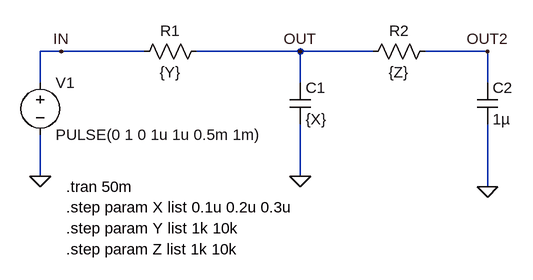
[diagram p0: schematic Cascated_RC_Filter.asc]
Cascated_RC_Filter.asc, the LTspice schematic file:
Version 4
SHEET 1 880 680
WIRE 0 48 -32 48
WIRE 128 48 0 48
WIRE 368 48 208 48
WIRE 480 48 368 48
WIRE 656 48 560 48
WIRE -32 96 -32 48
WIRE 368 96 368 48
WIRE 656 96 656 48
WIRE -32 240 -32 176
WIRE 368 240 368 160
WIRE 656 256 656 160
FLAG -32 240 0
FLAG 368 240 0
FLAG 656 256 0
FLAG 0 48 IN
FLAG 368 48 OUT
FLAG 656 48 OUT2
SYMBOL voltage -32 80 R0
WINDOW 123 0 0 Left 0
WINDOW 39 0 0 Left 0
SYMATTR InstName V1
SYMATTR Value PULSE(0 1 0 1u 1u 0.5m 1m)
SYMBOL res 224 32 R90
WINDOW 0 0 56 VBottom 2
WINDOW 3 32 56 VTop 2
SYMATTR InstName R1
SYMATTR Value {Y}
SYMBOL res 576 32 R90
WINDOW 0 0 56 VBottom 2
WINDOW 3 32 56 VTop 2
SYMATTR InstName R2
SYMATTR Value {Z}
SYMBOL cap 352 96 R0
SYMATTR InstName C1
SYMATTR Value {X}
SYMBOL cap 640 96 R0
SYMATTR InstName C2
SYMATTR Value 1µ
TEXT 8 256 Left 2 !.tran 50m
TEXT 8 288 Left 2 !.step param X list 0.1u 0.2u 0.3u
TEXT 8 320 Left 2 !.step param Y list 1k 10k
TEXT 8 352 Left 2 !.step param Z list 1k 10k

The netlist it stands for:
* Cascated_RC_Filter.asc
V1 IN 0 PULSE(0 1 0 1u 1u 0.5m 1m)
R1 OUT IN {Y}
R2 OUT2 OUT {Z}
C1 OUT 0 {X}
C2 OUT2 0 1µ
.tran 50m
.step param X list 0.1u 0.2u 0.3u
.step param Y list 1k 10k
.step param Z list 1k 10k
.backanno
.end

* Results of the author's LTspice run, read from the files saved beside the schematic
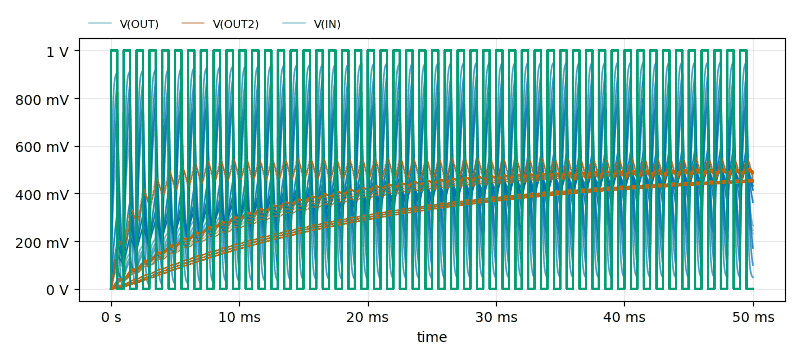
[diagram p1: Transient Analysis of Cascated_RC_Filter.asc, plotted from the saved traces]
* Transient Analysis, 12 runs:
*   V(OUT) [x=1e-007 y=1000 z=1000]: min 0 V, max 769.8 mV, average 491.3 mV, rms 539 mV, last 231.2 mV
*   V(OUT) [x=2e-007 y=1000 z=1000]: min 0 V, max 756 mV, average 490.8 mV, rms 526.9 mV, last 245.1 mV
*   V(OUT) [x=3e-007 y=1000 z=1000]: min 0 V, max 735.5 mV, average 490 mV, rms 516.9 mV, last 265.8 mV
*   V(OUT) [x=1e-007 y=10000 z=1000]: min 0 V, max 542 mV, average 394.8 mV, rms 412.4 mV, last 445.9 mV
*   V(OUT) [x=2e-007 y=10000 z=1000]: min 0 V, max 531 mV, average 385.6 mV, rms 403.7 mV, last 451.8 mV
*   V(OUT) [x=3e-007 y=10000 z=1000]: min 0 V, max 520.3 mV, average 376.6 mV, rms 395.4 mV, last 456.5 mV
*   V(OUT) [x=1e-007 y=1000 z=10000]: min 0 V, max 951.1 mV, average 490.6 mV, rms 610.2 mV, last 48.21 mV
*   V(OUT) [x=2e-007 y=1000 z=10000]: min 0 V, max 900.3 mV, average 490.8 mV, rms 562 mV, last 99.54 mV
*   V(OUT2) [x=1e-007 y=1000 z=1000]: min 0 V, max 553.3 mV, average 482.5 mV, rms 487.6 mV, last 451.2 mV
*   V(OUT2) [x=2e-007 y=1000 z=1000]: min 0 V, max 544.1 mV, average 481.5 mV, rms 486.7 mV, last 462.7 mV
*   V(OUT2) [x=3e-007 y=1000 z=1000]: min 0 V, max 536.8 mV, average 480.5 mV, rms 485.8 mV, last 472.2 mV
*   V(OUT2) [x=1e-007 y=10000 z=1000]: min 0 V, max 501.2 mV, average 385 mV, rms 404.9 mV, last 486.6 mV
*   V(OUT2) [x=2e-007 y=10000 z=1000]: min 0 V, max 496.1 mV, average 375.9 mV, rms 396.7 mV, last 486.7 mV
*   V(OUT2) [x=3e-007 y=10000 z=1000]: min 0 V, max 491.6 mV, average 366.9 mV, rms 388.6 mV, last 485.1 mV
*   V(OUT2) [x=1e-007 y=1000 z=10000]: min 0 V, max 503.9 mV, average 393.4 mV, rms 412.4 mV, last 488.4 mV
*   V(OUT2) [x=2e-007 y=1000 z=10000]: min 0 V, max 501.5 mV, average 392.5 mV, rms 411.8 mV, last 491.6 mV
*   V(IN) [x=1e-007 y=1000 z=1000]: min 0 V, max 1 V, average 501 mV, rms 707.7 mV, last 0 V
*   V(IN) [x=2e-007 y=1000 z=1000]: min 0 V, max 1 V, average 501 mV, rms 707.7 mV, last 0 V
*   V(IN) [x=3e-007 y=1000 z=1000]: min 0 V, max 1 V, average 501 mV, rms 707.7 mV, last 0 V
*   V(IN) [x=1e-007 y=10000 z=1000]: min 0 V, max 1 V, average 501 mV, rms 707.7 mV, last 0 V
*   V(IN) [x=2e-007 y=10000 z=1000]: min 0 V, max 1 V, average 501 mV, rms 707.7 mV, last 0 V
*   V(IN) [x=3e-007 y=10000 z=1000]: min 0 V, max 1 V, average 501 mV, rms 707.7 mV, last 0 V
*   V(IN) [x=1e-007 y=1000 z=10000]: min 0 V, max 1 V, average 501 mV, rms 707.6 mV, last 0 V
*   V(IN) [x=2e-007 y=1000 z=10000]: min 0 V, max 1 V, average 501 mV, rms 707.7 mV, last 0 V